# Altium schematic sheet fpv小车.SchDoc
size B
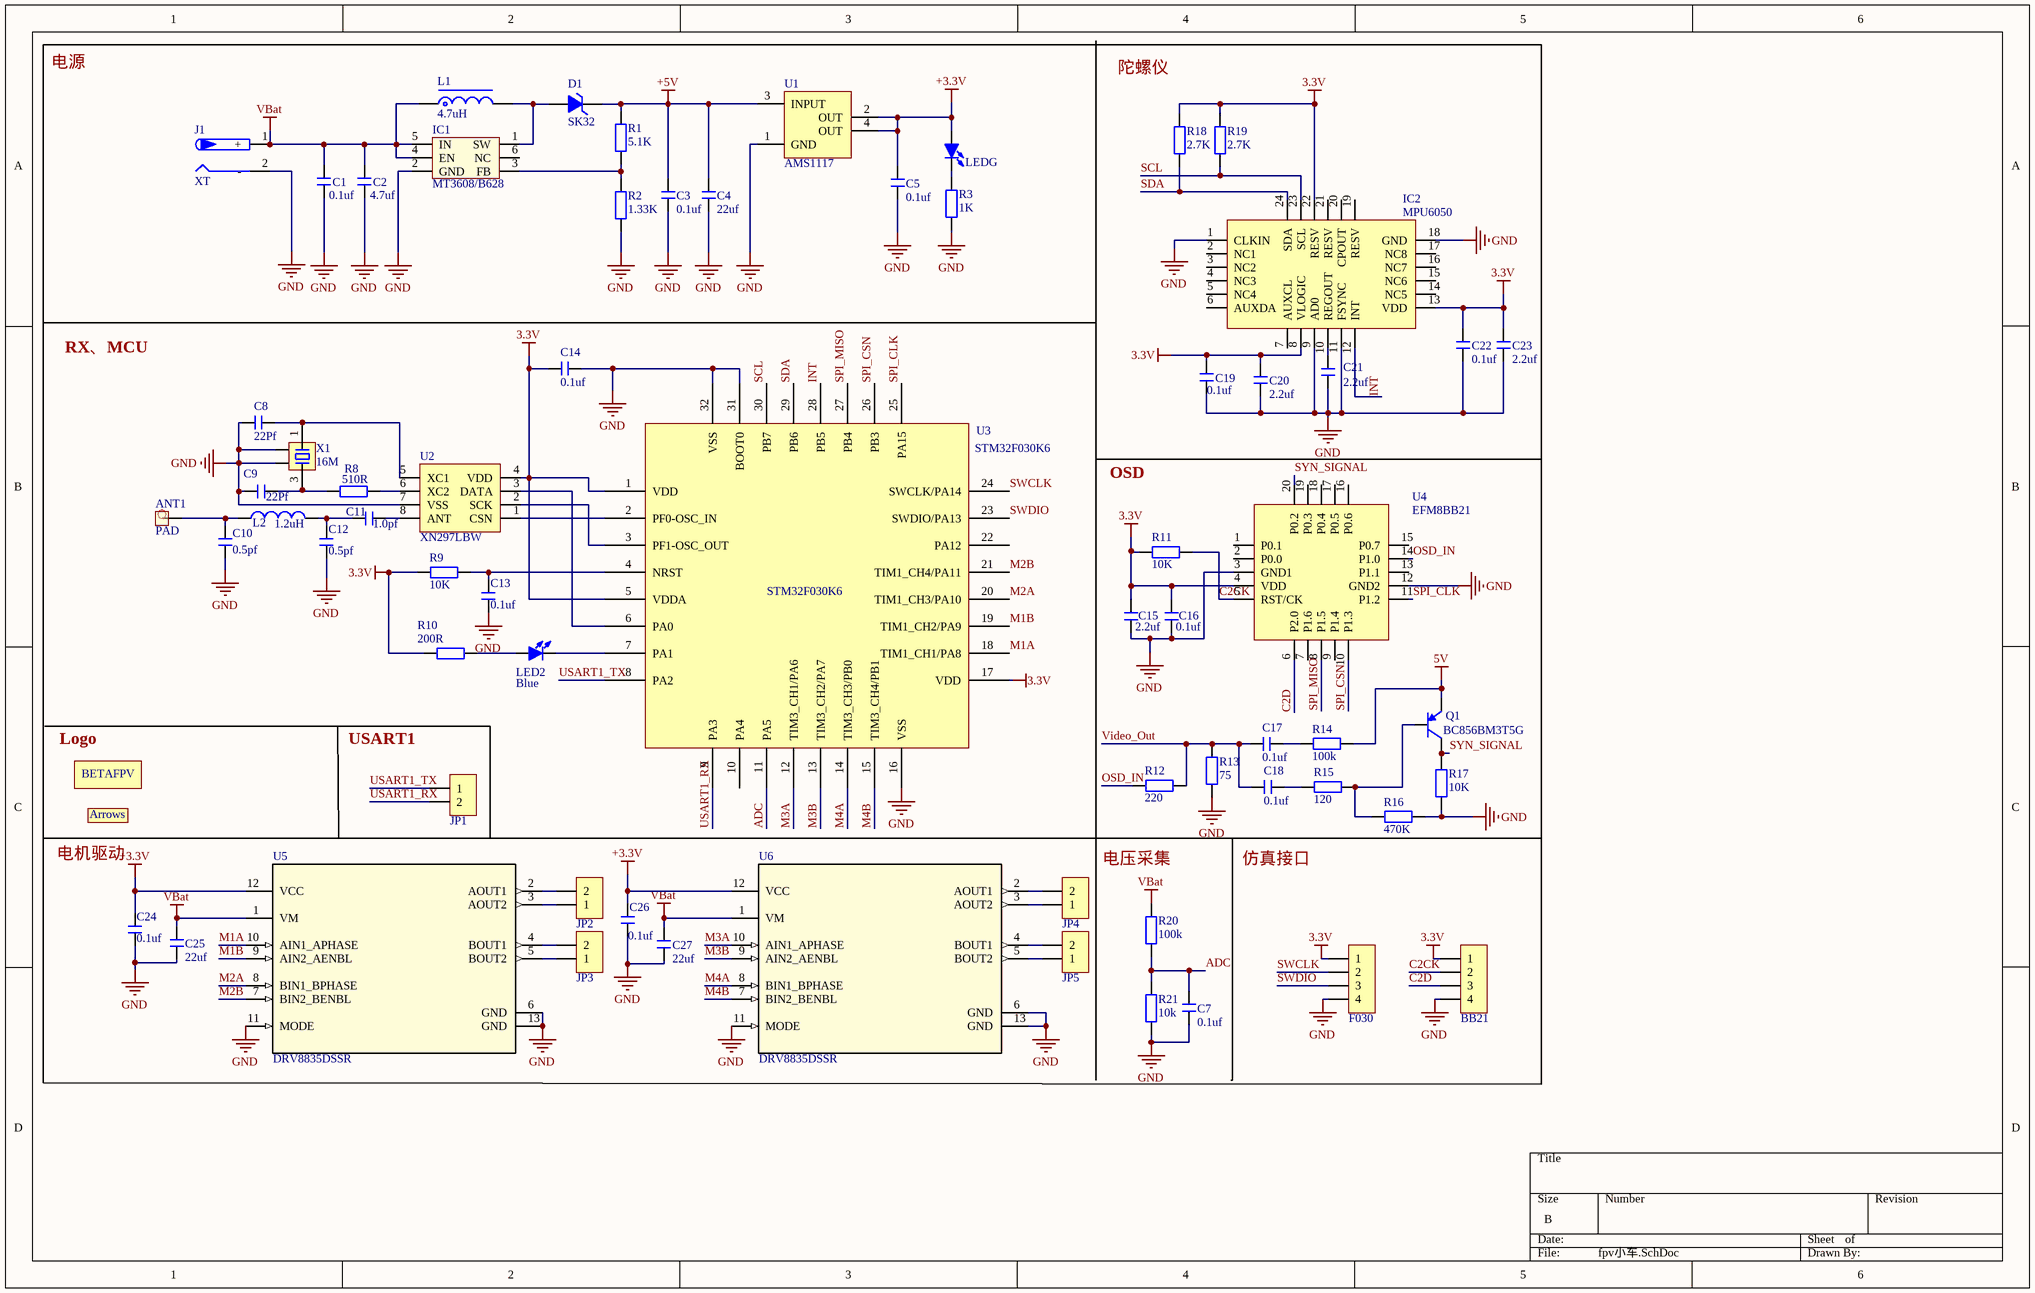
[diagram p0: fpv小车.SchDoc]

## Parts
ANT1  PAD  [PAD]
BB21  HDR-1X4  [L-1.25-4P - A]  (value not drawn)
C1  0.1uf  [0402-C-S-1.33*0.5]
C2  4.7uf  [0402-C-S-1.33*0.5]
C3  0.1uf  [0402-C-S-1.33*0.5]
C4  22uf  [C 0603_L]
C5  0.1uf  [0402-C-S-1.33*0.5]
C7  0.1uf  [0402-C-S-1.33*0.5]
C8  22Pf  [0402-C-S-1.33*0.5]
C9  22Pf  [0402-C-S-1.33*0.5]
C10  0.5pf  [0402-C-S-1.33*0.5]
C11  1.0pf  [0402-C-S-1.33*0.5]
C12  0.5pf  [0402-C-S-1.33*0.5]
C13  0.1uf  [0402-C-S-1.33*0.5]
C14  0.1uf  [0402-C-S-1.33*0.5]
C15  2.2uf  [0402-C-S-1.33*0.5]
C16  0.1uf  [0402-C-S-1.33*0.5]
C17  0.1uf  [0402-C-S-1.33*0.5]
C18  0.1uf  [0402-C-S-1.33*0.5]
C19  0.1uf  [0402-C-S-1.33*0.5]
C20  2.2uf  [0402-C-S-1.33*0.5]
C21  2.2uf  [0402-C-S-1.33*0.5]
C22  0.1uf  [0402-C-S-1.33*0.5]
C23  2.2uf  [0402-C-S-1.33*0.5]
C24  0.1uf  [0402-C-S-1.33*0.5]
C25  22uf  [0805-C-3.0*1.4]
C26  0.1uf  [0402-C-S-1.33*0.5]
C27  22uf  [0805-C-3.0*1.4]
D1  SK32  [SOD-123]
F030  HDR-1X4  [L-1.25-4P - A]  (value not drawn)
IC1  MT3608/B628  [L - SOT23-6L]
IC2  MPU6050  [QFN24 - 4*4*0.9]
J1  XT  [L - 20AWG]
JP1  HDR-1X2  [L-1.5-2p]  (value not drawn)
JP2  HDR-1X2  [MX 1.25-LI-2P]  (value not drawn)
JP3  HDR-1X2  [MX 1.25-LI-2P]  (value not drawn)
JP4  HDR-1X2  [MX 1.25-LI-2P]  (value not drawn)
JP5  HDR-1X2  [MX 1.25-LI-2P]  (value not drawn)
L1  4.7uH  [NR3010]
L2  1.2uH  [0402-L-1.6*0.5]
LED2  Blue  [LED 0603B]
LEDG  LED  [L-LED 0603B]  (value not drawn)
logo1  BETAFPV  [BETAFPV-7*1.5mm]  (value not drawn)
logo2  Arrows  [Arrows - B]  (value not drawn)
Q1  BC856BM3T5G  [SOT - 723 *1.05mm]
R1  5.1K  [0402-R-1.38*0.5]
R2  1.33K  [0402-R-1.38*0.5]
R3  1K  [0402-R-1.38*0.5]
R8  510R  [0402-R-1.38*0.5]
R9  10K  [0402-R-1.38*0.5]
R10  200R  [0402-R-1.38*0.5]
R11  10K  [0402-R-1.38*0.5]
R12  220  [0402-R-1.38*0.5]
R13  75  [0402-R-1.38*0.5]
R14  100k  [0402-R-1.38*0.5]
R15  120  [0402-R-1.38*0.5]
R16  470K  [0402-R-1.38*0.5]
R17  10K  [0402-R-1.38*0.5]
R18  2.7K  [0402-R-1.38*0.5]
R19  2.7K  [0402-R-1.38*0.5]
R20  100k  [0402-R-1.38*0.5]
R21  10k  [0402-R-1.38*0.5]
U1  AMS1117  [AMS1117-3D]
U2  XN297LBW  [HCXY-SOIC-8]
U3  STM32F030K6  [LQFP32 7X7_M]
U4  EFM8BB21  [L - QFN20]
U5  DRV8835DSSR  [DSS0012A]
U6  DRV8835DSSR  [DSS0012A]
X1  16M  [OSC 3225-4P]

## Nets
3.3V: BB21.1 C14.1 C15.2 C16.2 C19.2 C20.2 C22.2 C23.2 F030.1 IC2.8(VLOGIC) IC2.13(VDD) IC2.22(RESV) R9.2 R10.2 R11.1 R18.2 R19.2 U2.4(VDD) U3.1(VDD) U3.5(VDDA) U3.17(VDD) U4.4(VDD)
5V: Q1.2(E) R14.1
+3.3V: C5.2 C24.2 C26.2 LEDG.1(A) U1.2(OUT) U1.4(OUT) U5.12(VCC) U6.12(VCC)
+5V: C3.2 C4.2 D1.2 R1.2 U1.3(INPUT)
GND: BB21.4 C1.1 C2.1 C3.1 C4.1 C5.1 C7.2 C8.2 C9.1 C10.1 C12.1 C13.1 C14.2 C15.1 C16.1 C19.1 C20.1 C21.1 C22.1 C23.1 C24.1 C25.1 C26.1 C27.1 F030.4 IC1.2(GND) IC2.1(CLKIN) IC2.9(AD0) IC2.11(FSYNC) IC2.18(GND) J1.2(-) R2.1 R3.1 R13.1 R16.2 R17.1 R21.2 U1.1(GND) U2.7(VSS) U3.16(VSS) U3.31(BOOT0) U3.32(VSS) U4.3(GND1) U4.12(GND2) U5.6(GND) U5.11(MODE) U5.13(GND) U6.6(GND) U6.11(MODE) U6.13(GND) X1.2 X1.4
VBat: C1.2 C2.2 C25.2 C27.2 IC1.4(EN) IC1.5(IN) J1.1(+) L1.1 R20.1 U5.1(VM) U6.1(VM)
ADC: C7.1 R20.2 R21.1 U3.11(PA5)
C2CK: BB21.2 R11.2 U4.5(RST/CK)
C2D: BB21.3 U4.6(P2.0)
INT: IC2.12(INT) U3.28(PB5)
M1A: U3.18(TIM1_CH1/PA8) U5.10(AIN1_APHASE)
M1B: U3.19(TIM1_CH2/PA9) U5.9(AIN2_AENBL)
M2A: U3.20(TIM1_CH3/PA10) U5.8(BIN1_BPHASE)
M2B: U3.21(TIM1_CH4/PA11) U5.7(BIN2_BENBL)
M3A: U3.12(TIM3_CH1/PA6) U6.10(AIN1_APHASE)
M3B: U3.13(TIM3_CH2/PA7) U6.9(AIN2_AENBL)
M4A: U3.14(TIM3_CH3/PB0) U6.8(BIN1_BPHASE)
M4B: U3.15(TIM3_CH4/PB1) U6.7(BIN2_BENBL)
OSD_IN: R12.2 U4.14(P1.0)
SCL: IC2.23(SCL) R19.1 U3.30(PB7)
SDA: IC2.24(SDA) R18.1 U3.29(PB6)
SPI_CLK: U3.25(PA15) U4.11(P1.2)
SPI_CSN: U3.26(PB3) U4.10(P1.3)
SPI_MISO: U3.27(PB4) U4.8(P1.5)
SWCLK: F030.2 U3.24(SWCLK/PA14)
SWDIO: F030.3 U3.23(SWDIO/PA13)
SYN_SIGNAL: Q1.3(C) R17.2 U4.20(P0.2)
USART1_RX: JP1.2 U3.9(PA3)
USART1_TX: JP1.1 U3.8(PA2)
Video_Out: C17.2 C18.2 R12.1 R13.2
NetANT1_0: ANT1.0 C10.2 L2.1
NetC8_1: C8.1 U2.5(XC1) X1.1
NetC9_2: C9.2 R8.1 X1.3
NetC11_1: C11.1 U2.8(ANT)
NetC11_2: C11.2 C12.2 L2.2
NetC13_2: C13.2 R9.1 U3.4(NRST)
NetC17_1: C17.1 R14.2
NetC18_1: C18.1 R15.2
NetC21_2: C21.2 IC2.10(REGOUT)
NetD1_1: D1.1 IC1.1(SW) L1.2
NetIC1_3: IC1.3(FB) R1.1 R2.2
NetJP2_1: JP2.1 U5.3(AOUT2)
NetJP2_2: JP2.2 U5.2(AOUT1)
NetJP3_1: JP3.1 U5.5(BOUT2)
NetJP3_2: JP3.2 U5.4(BOUT1)
NetJP4_1: JP4.1 U6.3(AOUT2)
NetJP4_2: JP4.2 U6.2(AOUT1)
NetJP5_1: JP5.1 U6.5(BOUT2)
NetJP5_2: JP5.2 U6.4(BOUT1)
NetLED2_1: LED2.1(A) R10.1
NetLED2_2: LED2.2(K) U3.7(PA1)
NetLEDG_2: LEDG.2(K) R3.2
NetQ1_1: Q1.1(B) R15.1 R16.1
NetR8_2: R8.2 U2.6(XC2)
NetU2_1: U2.1(CSN) U3.2(PF0-OSC_IN)
NetU2_2: U2.2(SCK) U3.3(PF1-OSC_OUT)
NetU2_3: U2.3(DATA) U3.6(PA0)

Not connected (* = marked no-connect by the designer): IC1 6(NC); IC2 2(NC1) 3(NC2) 4(NC3) 5(NC4) 6(AUXDA) 7(AUXCL) 14(NC5) 15(NC6) 16(NC7) 17(NC8) 19(RESV) 20(CPOUT) 21(RESV); U3 10(PA4) 22(PA12); U4 1(P0.1) 2(P0.0) 7(P1.6) 9(P1.4) 13(P1.1) 15(P0.7) 16(P0.6) 17(P0.5) 18(P0.4) 19(P0.3)

## Notes on the sheet
- 电源
- 陀螺仪
- RX、MCU
- OSD
- (near logo1) Logo
- USART1
- (near logo2) 电机驱动
- 电压采集
- 仿真接口

## Library data of the parts
BB21 F030 = Header 4: 4P接插件; 版权归属: 源创客; BOM名称: 4P接插件; 学习资源: www.ooocke.com
C1-C5 C7-C24 C26 = C
C25 C27 = C: 无极性贴片电容; 版权归属: 源创客; BOM名称: 无极性贴片电容; 学习资源: www.ooocke.com
D1 = 1N4148WT
IC2 = MPU6050: 版权所有: 河池学院智能控制重点实验室; Library name: 传感器; 了解我们: http://www.jianshengdrlab.com
J1 = 电源接口
JP1 = Header 2: BOM名称: 2P测试孔; 版权归属: Ly
JP2-JP5 = Header 2: 2P接插件; 版权归属: 源创客; BOM名称: 2P接插件; 学习资源: www.ooocke.com
L1 = L-NR: NR磁胶电感; 版权归属: 源创客; BOM名称: NR磁胶电感; 学习资源: www.ooocke.com
L2 = L
LED2 = LED-SMD: 贴片LED; 版权归属: 源创客; BOM名称: 贴片LED; 学习资源: www.ooocke.com
LEDG = LED-2PIN
logo1 = BETAFPV: 版权所有: 深圳市哈鸣科技有限公司; 说明: 公司logo; 名称: BETAFPV
logo2 = Arrows: 名称: 箭头; 版权所有: 深圳市哈鸣科技有限公司; 说明: 无人机方向箭头
Q1 = 9015-SMD: 低噪放大-PNP型; 版权归属: 源创客; 属性: 50V 0.1A 0.4W 150MHZ; BOM名称: 低噪放大-PNP型; 学习资源: www.ooocke.com
R1-R3 R8-R21 = R
U5 U6 = DRV8835DSSR: Imported; Manufacturer: Texas Instruments; PartNumber: DRV8835DSSR; RefDes: RefDes; TYPE: TYPE; Value: Value
X1 = XTAL-4P: 4脚无源晶振; 版权归属: 源创客; BOM名称: 4脚无源晶振; 学习资源: www.ooocke.com